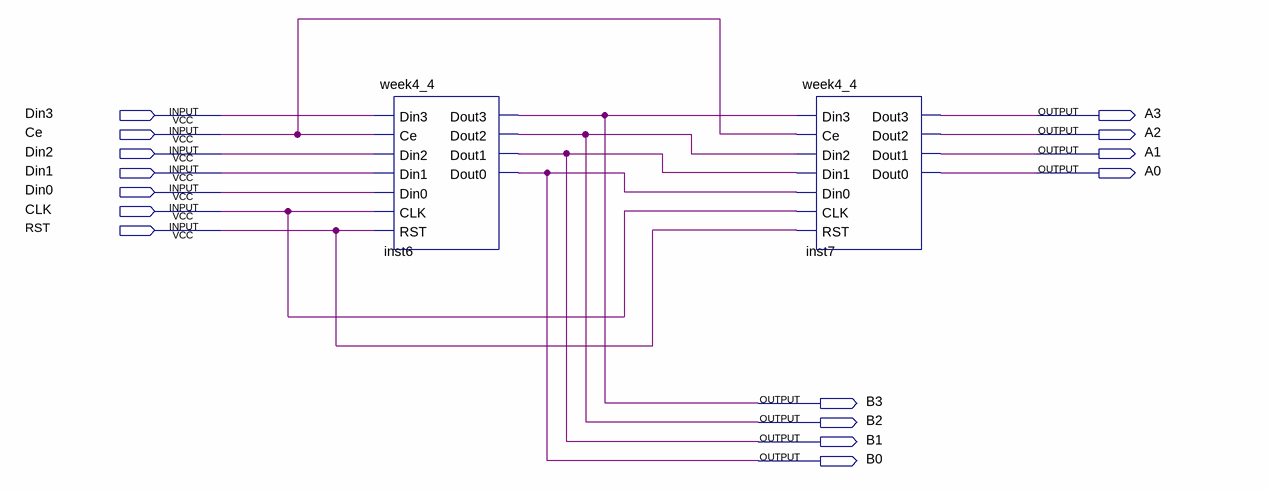
[diagram p0: schematic sheet]
// Quartus schematic week4_5.bdf as structural Verilog: 2 symbols, 15 pins
module week4_5 (
  input  Din3,
  input  Ce,
  input  Din2,
  input  Din1,
  input  Din0,
  input  CLK,
  input  RST,
  output A3,
  output A2,
  output A1,
  output A0,
  output B3,
  output B2,
  output B1,
  output B0
);

  week4_4 inst6 (
    .Din3(Din3), .Ce(Ce), .Din2(Din2), .Din1(Din1), .Din0(Din0), .CLK(CLK), .RST(RST), .Dout3(B3),
    .Dout2(B2), .Dout1(B1), .Dout0(B0));
  week4_4 inst7 (
    .Din3(B3), .Ce(Ce), .Din2(B2), .Din1(B1), .Din0(B0), .CLK(CLK), .RST(RST), .Dout3(A3), .Dout2(A2),
    .Dout1(A1), .Dout0(A0));
endmodule
